# EAGLE design Current Sensor v1.0 (EAGLE 7.4.0)
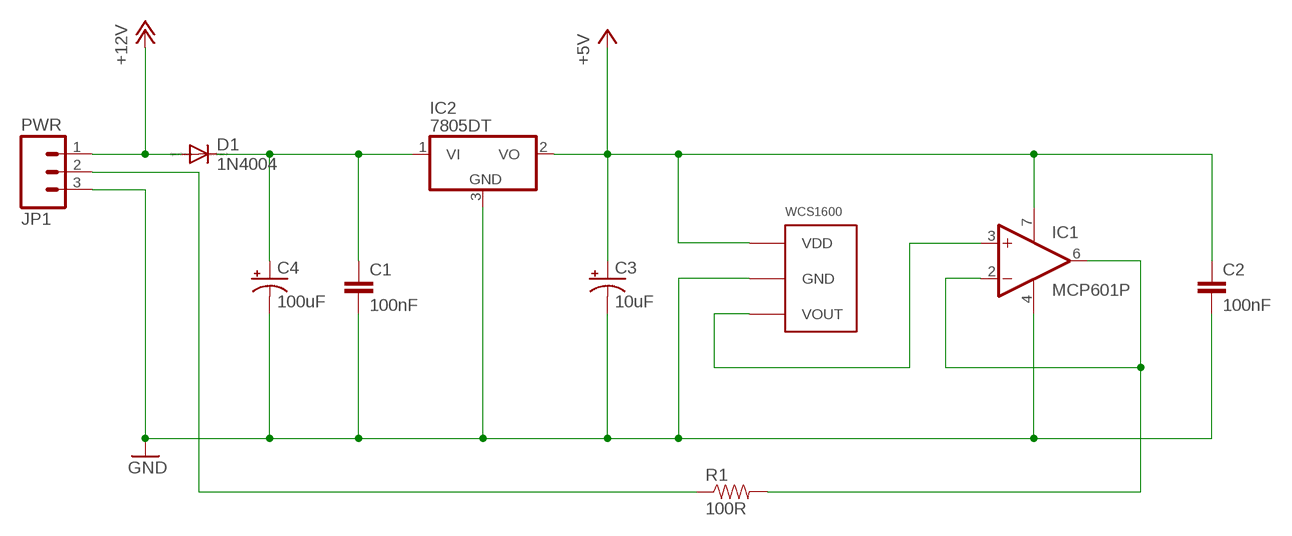
[diagram p0: schematic, sheet 1]

## Parts
C1  100nF  0.1UF-50V-20%(PTH)KIT-EZ  [CAP-PTH-SMALL-KIT]
C2  100nF  0.1UF-50V-20%(PTH)KIT-EZ  [CAP-PTH-SMALL-KIT]
C3  10uF  10UF-25V-20%(PTH)KIT  [CPOL-RADIAL-10UF-25V-KIT]
C4  100uF  100UF-25V-20%(PTH)  [CPOL-RADIAL-100UF-25V]
D1  1N4004  [DO41-10]
IC1  MCP601P  [DIL08]
IC2  7805DT  [TO252]
JP1  PWR  M03POLAR  [MOLEX-1X3]
R1  100R  RESISTORAXIAL-0.3  [AXIAL-0.3]
U$1  WCSXXXX  [WCSXXXX]

## Nets
+5V: C2.1 C3.1(+) IC1.7(V+) IC2.2(VO) U$1.P$1(VDD)
+12V: D1.A JP1.1
GND: C1.2 C2.2 C3.2(-) C4.2(-) IC1.4(V-) IC2.3(GND) JP1.3 U$1.P$2(GND)
N$1: IC1.2(-IN) IC1.6(OUT) R1.P$2
N$2: C1.1 C4.1(+) D1.C IC2.1(VI)
N$3: JP1.2 R1.P$1
N$5: IC1.3(+IN) U$1.P$3(VOUT)

## Library data of the parts
C1 C2 = SparkFun-Capacitors:0.1UF-50V-20%(PTH): CAP-08370; PROD_ID: CAP-08370
C3 = SparkFun-Capacitors:10UF-25V-20%(PTH): CAP-08440; PROD_ID: CAP-08440
C4 = SparkFun-Capacitors:100UF-25V-20%(PTH): CAP-08439; PROD_ID: CAP-08439
D1 = diode:1N4004: DIODE general purpose rectifier, 1 A
IC1 = linear:MCP601: Single Op Amp 2.7V to 6.0V Single Supply CMOS Source: http://ww1.microchip.com/downloads/en/DeviceDoc/21314g.pdf
IC2 = linear:78*: Positive VOLTAGE REGULATOR Source: http://cache.national.com/ds/LM/LM78L05.pdf http://www.fairchildsemi.com/ds/LM/LM7805.pdf
JP1 = SparkFun-Connectors:M03: Header 3 Standard 3-pin 0.1" header. Use with straight break away headers (SKU : PRT-00116), right angle break away headers (PRT-00553), swiss pins (PRT-00743), machine pins (PRT-00117), and female headers (PRT-00115). Molex polarized connector foot print use with SKU : PRT-08232 with associated crimp pins and housings.
R1 = SparkFun-Passives:RESISTOR: Resistor Basic schematic elements and footprints for 0603, 1206, and PTH resistors.
U$1 = aaa-flatcatit:WCSXXXX: Winston Hall Effect Current Sensor

## Board
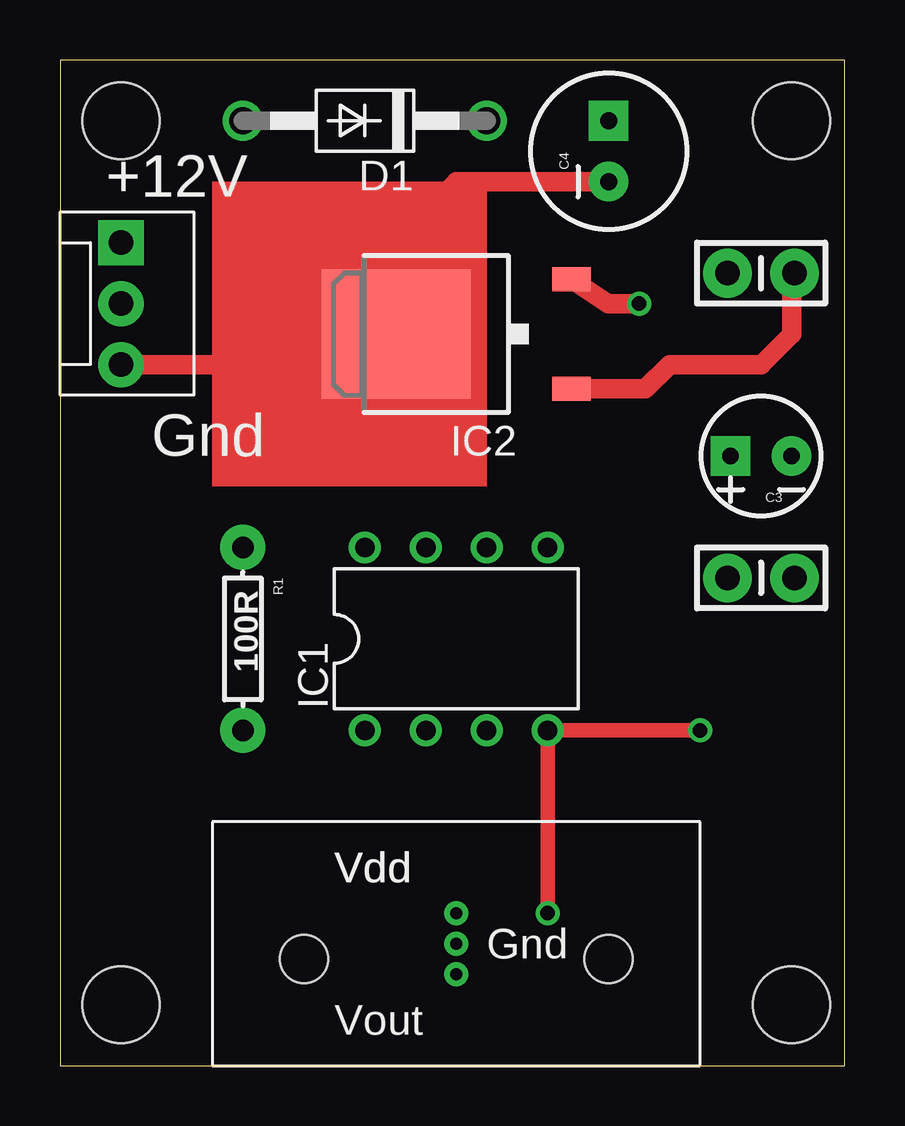
[diagram p1: board, top side]
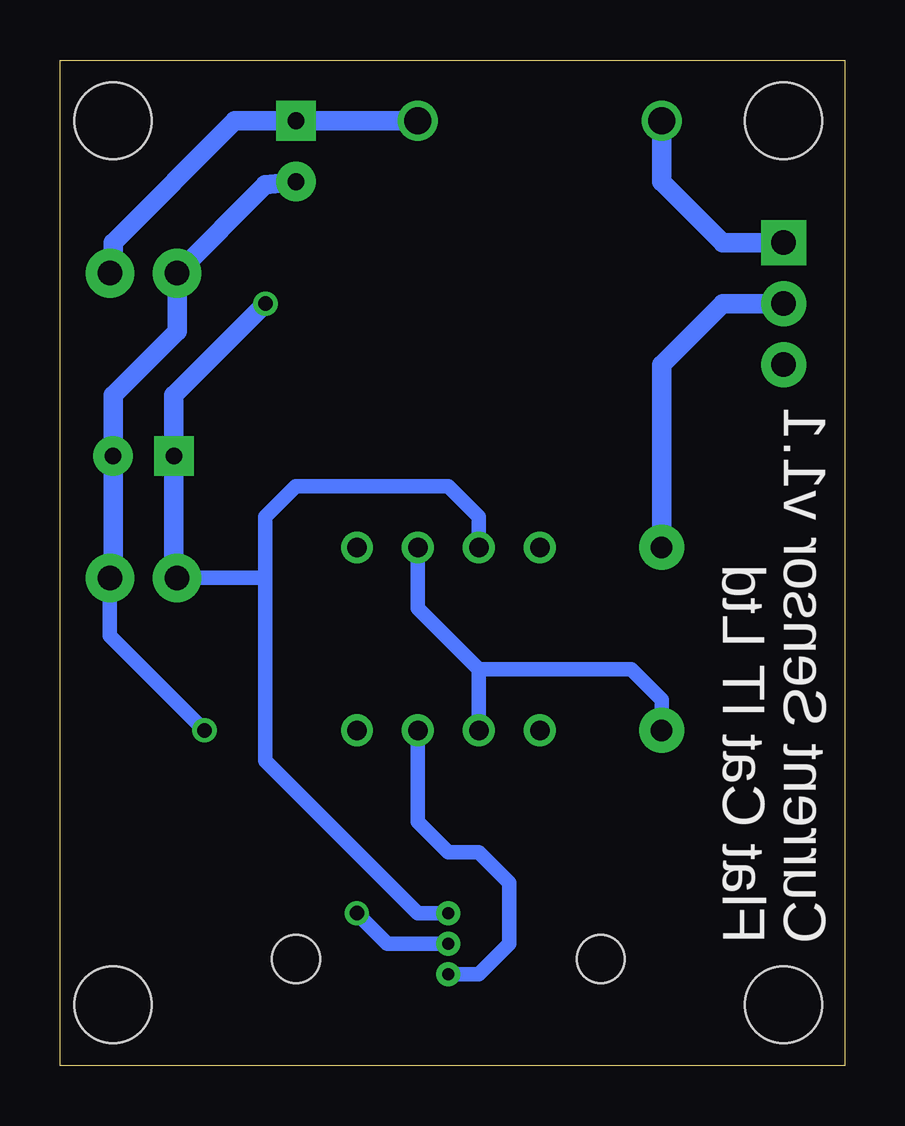
[diagram p2: board, bottom side, seen from below]

Size 32.69 x 41.9 mm. Coordinates in mm from the lower left corner, seen from the top.
Outline: 0,0 32.69,0 32.69,41.9 0,41.9 0,0
Copper layers (1*16): Top 0.035mm / dielectric 1.5mm / Bottom 0.035mm
Design rules "default": minimum track width 10mil, minimum drill 24mil, track to track 8mil, track to pad 8mil, pad to pad 8mil, via to via 8mil, smd to smd 8mil, copper to edge 40mil, drill to drill 8mil, minimum pad ring 10mil, minimum via ring 8mil, stop-mask expansion 4mil, vias tented up to drill 0mil, thermal gap 10mil
Holes 3.2 mm at 2.54,2.54 30.48,2.54 30.48,39.37 2.54,39.37

### Footprints (pad centres in the part's own frame; a part is rotated, then mirrored left to right if it is on the bottom)
CAP-PTH-SMALL-KIT = drill 1.016 pad 2.032: 1 -1.397,0; 2 1.397,0
CPOL-RADIAL-10UF-25V-KIT = drill 0.7 pad 1.651 square: 1 1.27,0 | drill 0.7 pad 1.651: 2 -1.27,0
CPOL-RADIAL-100UF-25V = drill 0.7 pad 1.651 square: 1 1.27,0 | drill 0.7 pad 1.651: 2 -1.27,0
DO41-10 = drill 1.118: A 5.08,0; C -5.08,0
DIL08 = drill 0.813 pad 1.27: 1 -3.81,-3.81; 2 -1.27,-3.81; 3 1.27,-3.81; 4 3.81,-3.81; 5 3.81,3.81; 6 1.27,3.81; 7 -1.27,3.81; 8 -3.81,3.81
TO252 = smd 1 x 1.6: 1 -2.28,-4.8; 2 2.28,-4.8 | smd 5.4 x 6.2: 3 0,2.5
MOLEX-1X3 = drill 1.016 pad 1.88 square: 1 0,0 | drill 1.016 pad 1.88: 2 2.54,0; 3 5.08,0
AXIAL-0.3 = drill 0.9 pad 1.88: P$1 -3.81,0; P$2 3.81,0
WCSXXXX = drill 0.5: P$1 0,-3.81; P$2 0,-5.08; P$3 0,-6.35 | hole 2: 6.35,-5.715; -6.35,-5.715

### Placement (x,y rotation side)
C1  29.21,33.02 180 top
C2  29.21,20.32 0 top
C3  29.21,25.4 180 top
C4  22.86,38.1 90 top
D1  12.7,39.37 180 top
IC1  16.51,17.78 0 top
IC2  16.51,30.48 90 top
JP1  2.54,34.29 270 top
R1  7.62,17.78 270 top
U$1  16.51,10.16 0 top

### Tracks (layer width: path | path; a pad name or v marks a point on that pad's centre or on a via)
+5V  (via drill 0.6)
  Top 0.813: v24.13,31.75 22.84,31.75 IC2.2
  Bottom 0.61: IC1.7 15.24,22.86 16.51,24.13 22.86,24.13 24.13,22.86 24.13,20.32 | 24.13,20.32 C2.1 | U$1.P$1 17.78,6.35 24.13,12.7 24.13,20.32
  Bottom 0.813: v24.13,31.75 27.94,27.94 C3.1 27.94,20.45 C2.1
+12V
  Bottom 0.813: JP1.1 5.08,34.29 7.62,36.83 D1.A
GND  (via drill 0.6)
  Top 0.61: v26.67,13.97 IC1.4 v20.32,6.35
  Top 0.813: JP1.3 8.89,29.21 10.16,30.48 IC2.3 13.97,30.52 13.97,34.29 16.51,36.83 C4.2
  Bottom 0.61: v20.32,6.35 19.05,5.08 U$1.P$2 | C2.2 30.61,17.91 v26.67,13.97
  Bottom 0.813: C4.2 24.13,36.7 C1.2 27.81,30.61 30.48,27.94 C3.2 30.48,20.45 C2.2
N$1
  Bottom 0.61: IC1.6 17.78,19.05 15.24,16.51 | 15.24,16.51 IC1.2 | R1.P$2 7.62,15.24 8.89,16.51 15.24,16.51
N$2
  Top 0.813: IC2.1 24.39,28.2 25.4,29.21 29.21,29.21 30.48,30.48 30.48,32.89 C1.1
  Bottom 0.813: D1.C C4.1 25.4,39.37 30.48,34.29 30.48,33.15 C1.1
N$3
  Bottom 0.813: JP1.2 5.08,31.75 7.62,29.21 R1.P$1
N$5
  Bottom 0.61: U$1.P$3 15.24,3.81 13.97,5.08 13.97,7.62 15.24,8.89 16.51,8.89 17.78,10.16 IC1.3
(copper drawn outside any net)
  shapes: Top area x1

### Text on the board
tNames: +12V | Gnd
bNames: Current Sensor v1.1 | Flat Cat IT Ltd